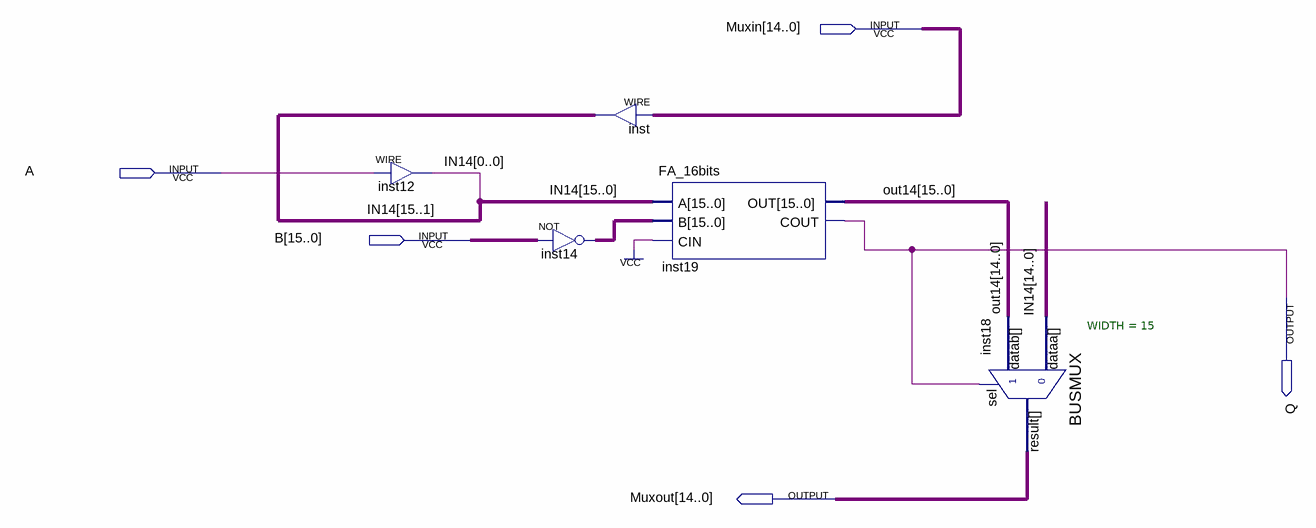
[diagram p0: schematic sheet]
// Quartus schematic DIVLAYER.bdf as structural Verilog: 5 symbols, 5 pins
module DIVLAYER (
  input  [14:0] Muxin,
  input  A,
  input  [15:0] B,
  output Q,
  output [14:0] Muxout
);

  wire [15:0] IN14, inst14_out, out14;

  assign IN14[0] = A;  // WIRE inst12
  assign inst14_out = ~B;  // NOT inst14, 16 bits wide
  assign IN14[15:1] = Muxin;  // WIRE inst
  FA_16bits inst19 (.A(IN14), .B(inst14_out), .CIN(1'b1), .OUT(out14), .COUT(Q));
  BUSMUX #(.WIDTH(15)) inst18 (.datab(out14[14:0]), .sel(Q), .dataa(IN14[14:0]), .result(Muxout));
endmodule
